# Altium schematic sheet Sheet3.SchDoc
size A3
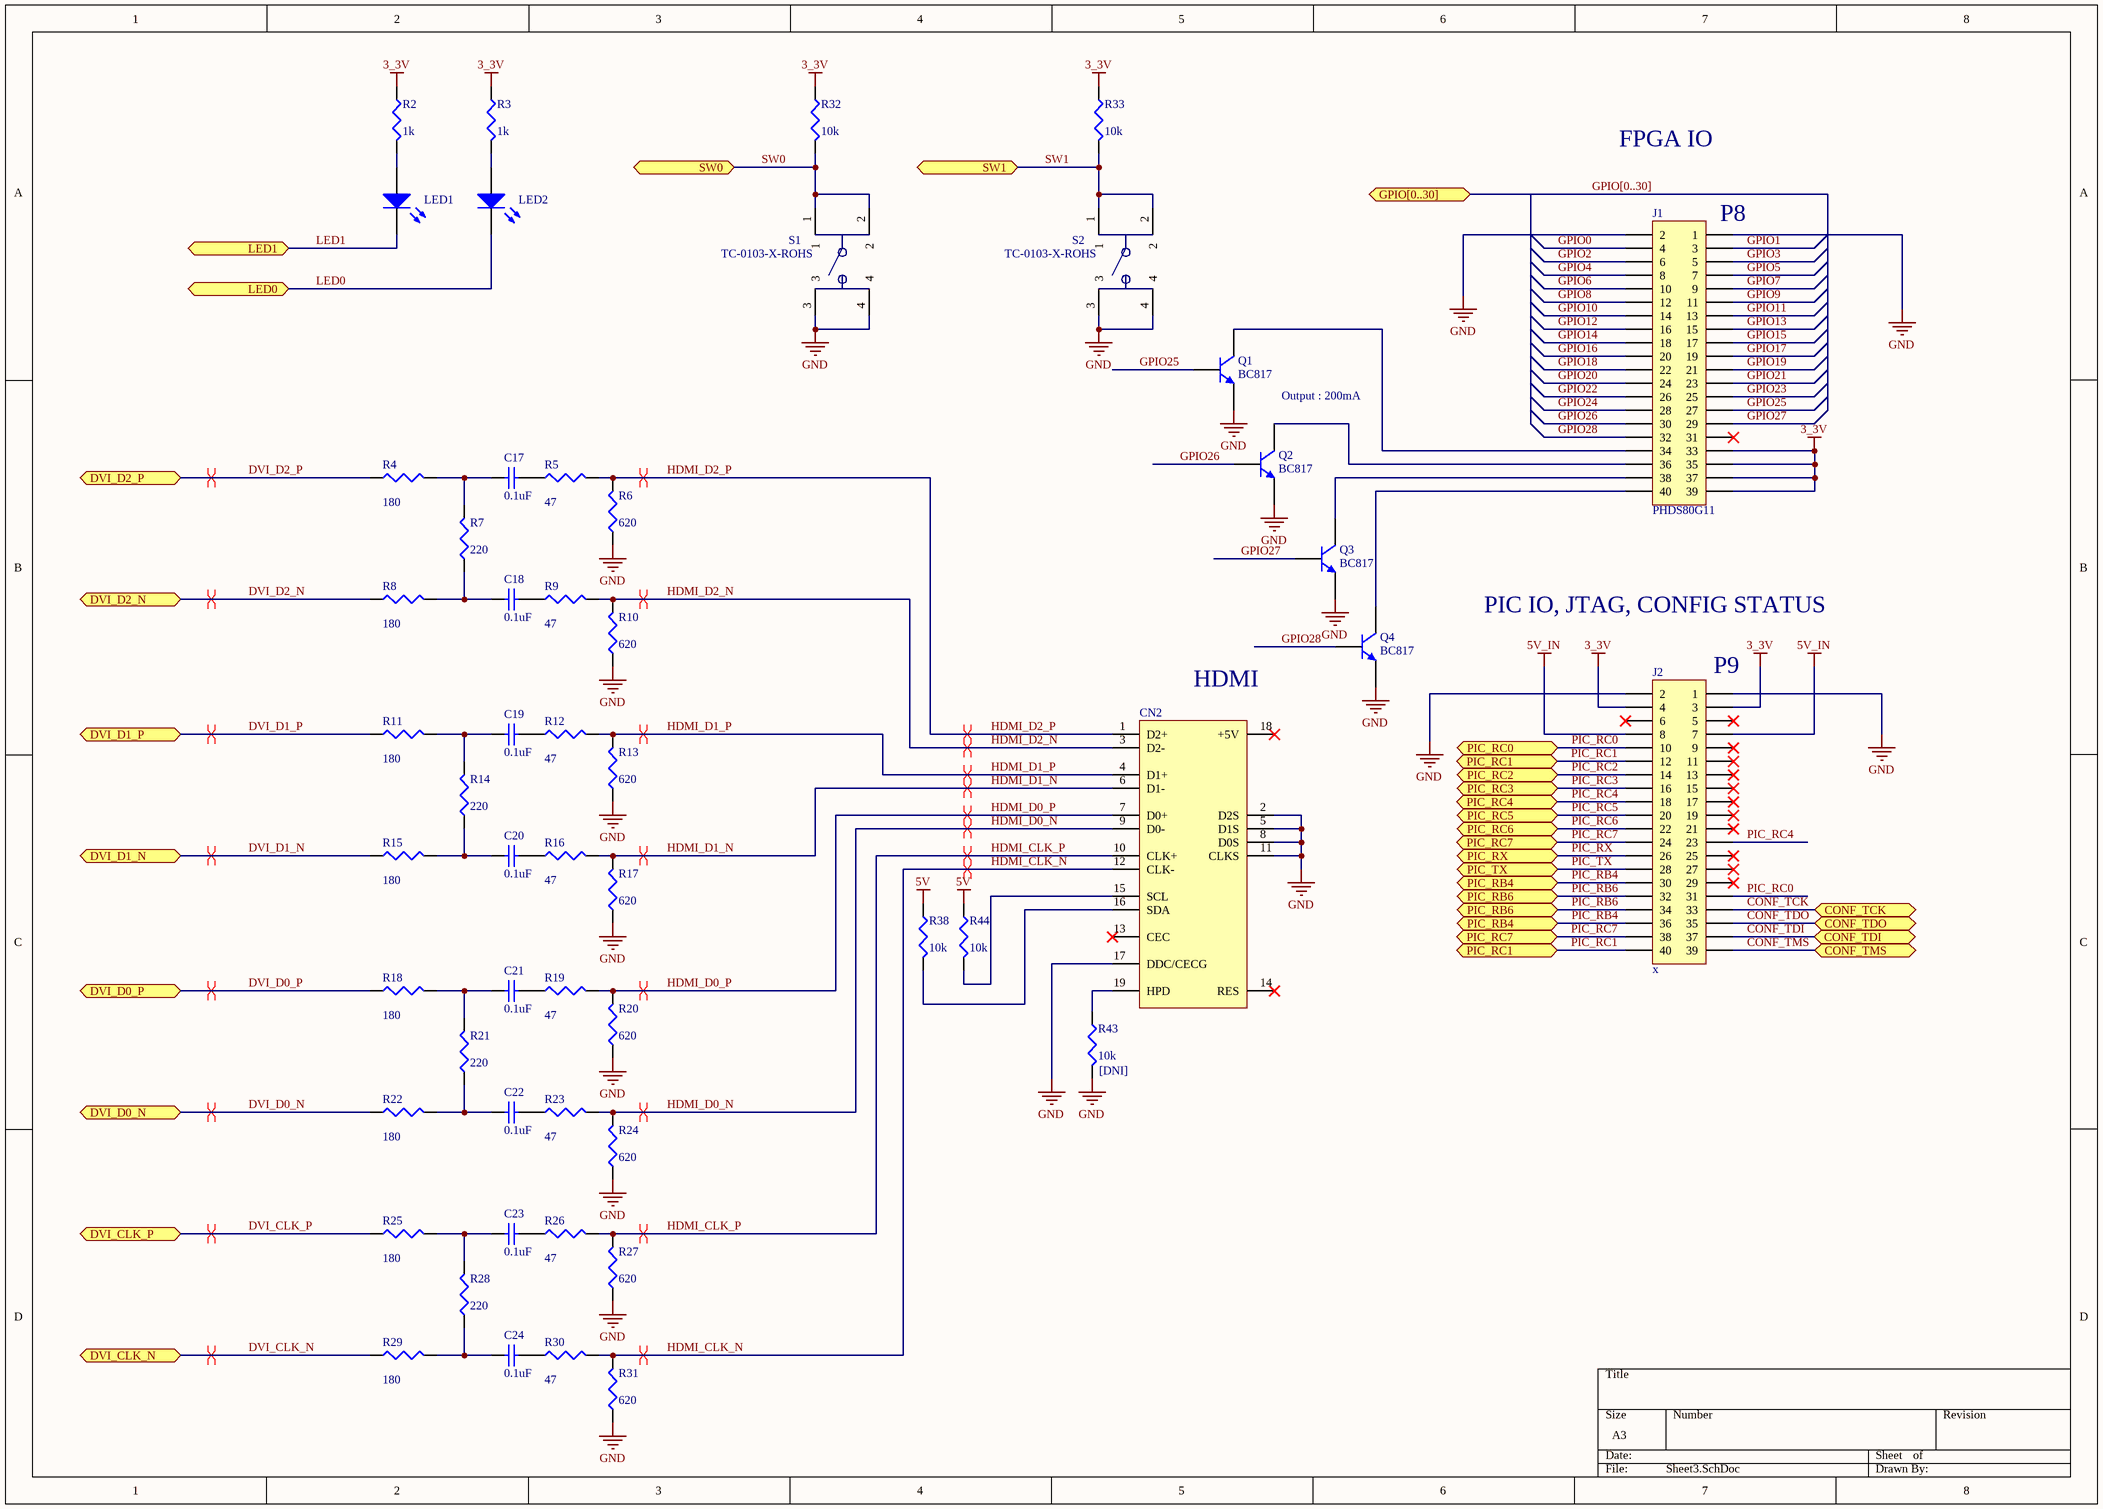
[diagram p0: Sheet3.SchDoc]

## Parts
C17  value 0.1uF  [CHIP1608]  (hidden comment: MCWR06X000 PTL)
C18  value 0.1uF  [CHIP1608]  (hidden comment: MCWR06X000 PTL)
C19  value 0.1uF  [CHIP1608]  (hidden comment: MCWR06X000 PTL)
C20  value 0.1uF  [CHIP1608]  (hidden comment: MCWR06X000 PTL)
C21  value 0.1uF  [CHIP1608]  (hidden comment: MCWR06X000 PTL)
C22  value 0.1uF  [CHIP1608]  (hidden comment: MCWR06X000 PTL)
C23  value 0.1uF  [CHIP1608]  (hidden comment: MCWR06X000 PTL)
C24  value 0.1uF  [CHIP1608]  (hidden comment: MCWR06X000 PTL)
CN2  10029449-001RLF  [10029449-001RLF]  (value not drawn)
J1  PHDS80G11  [HDR2X20-Gemini]
J2  x  [HDR2X20-Gemini]
LED1  TO-3216BC-MAE  [LED3216]  (value not drawn)
LED2  TO-3216BC-MAE  [LED3216]  (value not drawn)
Q1  BC817  [SOT-23]
Q2  BC817  [SOT-23]
Q3  BC817  [SOT-23]
Q4  BC817  [SOT-23]
R2  value 1k  [CHIP1608]  (hidden comment: MCMR06X1001FTL)
R3  value 1k  [CHIP1608]  (hidden comment: MCMR06X1001FTL)
R4  value 180  [CHIP1608]  (hidden comment: MC0063W06031270R)
R5  value 47  [CHIP1608]  (hidden comment: MCWR06X000 PTL)
R6  value 620  [CHIP1608]  (hidden comment: MCMR06X1001FTL)
R7  value 220  [CHIP1608]  (hidden comment: MCMR06X1001FTL)
R8  value 180  [CHIP1608]  (hidden comment: MC0063W06031270R)
R9  value 47  [CHIP1608]  (hidden comment: MCWR06X000 PTL)
R10  value 620  [CHIP1608]  (hidden comment: MCMR06X1001FTL)
R11  value 180  [CHIP1608]  (hidden comment: MC0063W06031270R)
R12  value 47  [CHIP1608]  (hidden comment: MCWR06X000 PTL)
R13  value 620  [CHIP1608]  (hidden comment: MCMR06X1001FTL)
R14  value 220  [CHIP1608]  (hidden comment: MCMR06X1001FTL)
R15  value 180  [CHIP1608]  (hidden comment: MC0063W06031270R)
R16  value 47  [CHIP1608]  (hidden comment: MCWR06X000 PTL)
R17  value 620  [CHIP1608]  (hidden comment: MCMR06X1001FTL)
R18  value 180  [CHIP1608]  (hidden comment: MC0063W06031270R)
R19  value 47  [CHIP1608]  (hidden comment: MCWR06X000 PTL)
R20  value 620  [CHIP1608]  (hidden comment: MCMR06X1001FTL)
R21  value 220  [CHIP1608]  (hidden comment: MCMR06X1001FTL)
R22  value 180  [CHIP1608]  (hidden comment: MC0063W06031270R)
R23  value 47  [CHIP1608]  (hidden comment: MCWR06X000 PTL)
R24  value 620  [CHIP1608]  (hidden comment: MCMR06X1001FTL)
R25  value 180  [CHIP1608]  (hidden comment: MC0063W06031270R)
R26  value 47  [CHIP1608]  (hidden comment: MCWR06X000 PTL)
R27  value 620  [CHIP1608]  (hidden comment: MCMR06X1001FTL)
R28  value 220  [CHIP1608]  (hidden comment: MCMR06X1001FTL)
R29  value 180  [CHIP1608]  (hidden comment: MC0063W06031270R)
R30  value 47  [CHIP1608]  (hidden comment: MCWR06X000 PTL)
R31  value 620  [CHIP1608]  (hidden comment: MCMR06X1001FTL)
R32  value 10k  [CHIP1608]  (hidden comment: MCWR06X1002FTL)
R33  value 10k  [CHIP1608]  (hidden comment: MCWR06X1002FTL)
R38  value 10k  [CHIP1608]  (hidden comment: MCWR06X1002FTL)
R43  value 10k  assembly: [DNI]  [CHIP1608]  (hidden comment: MCWR06X1002FTL)
R44  value 10k  [CHIP1608]  (hidden comment: MCWR06X1002FTL)
S1  TC-0103-X-ROHS  [TACK_SW 6x6mm]
S2  TC-0103-X-ROHS  [TACK_SW 6x6mm]

## Ports
CONF_TCK, CONF_TDI, CONF_TDO, CONF_TMS, DVI_CLK_N, DVI_CLK_P, DVI_D0_N, DVI_D0_P, DVI_D1_N, DVI_D1_P, DVI_D2_N, DVI_D2_P, GPIO[0..30], LED0, LED1, PIC_RB4, PIC_RB6, PIC_RC0, PIC_RC1, PIC_RC2, PIC_RC3, PIC_RC4, PIC_RC5, PIC_RC6, PIC_RC7, PIC_RX, PIC_TX, SW0, SW1

## Nets
3_3V: J1.33 J1.35 J1.37 J1.39 J2.3 J2.4 R2.1 R3.1 R32.1 R33.1
5V: R38.1 R44.1
5V_IN: J2.7 J2.8
GND: CN2.2(D2S) CN2.5(D1S) CN2.8(D0S) CN2.11(CLKS) CN2.17(DDC/CECG) J1.1 J1.2 J2.1 J2.2 Q1.2(E) Q2.2(E) Q3.2(E) Q4.2(E) R6.1 R10.1 R13.1 R17.1 R20.1 R24.1 R27.1 R31.1 R43.2 S1.3 S1.4 S2.3 S2.4
CONF_TCK: J2.33 ; port CONF_TCK
CONF_TDI: J2.37 ; port CONF_TDI
CONF_TDO: J2.35 ; port CONF_TDO
CONF_TMS: J2.39 ; port CONF_TMS
DVI_CLK_N: R29.1 ; port DVI_CLK_N
DVI_CLK_P: R25.1 ; port DVI_CLK_P
DVI_D0_N: R22.1 ; port DVI_D0_N
DVI_D0_P: R18.1 ; port DVI_D0_P
DVI_D1_N: R15.1 ; port DVI_D1_N
DVI_D1_P: R11.1 ; port DVI_D1_P
DVI_D2_N: R8.1 ; port DVI_D2_N
DVI_D2_P: R4.1 ; port DVI_D2_P
GPIO0: J1.4
GPIO1: J1.3
GPIO2: J1.6
GPIO3: J1.5
GPIO4: J1.8
GPIO5: J1.7
GPIO6: J1.10
GPIO7: J1.9
GPIO8: J1.12
GPIO9: J1.11
GPIO10: J1.14
GPIO11: J1.13
GPIO12: J1.16
GPIO13: J1.15
GPIO14: J1.18
GPIO15: J1.17
GPIO16: J1.20
GPIO17: J1.19
GPIO18: J1.22
GPIO19: J1.21
GPIO20: J1.24
GPIO21: J1.23
GPIO22: J1.26
GPIO23: J1.25
GPIO24: J1.28
GPIO25: J1.27 Q1.1(B)
GPIO26: J1.30 Q2.1(B)
GPIO27: J1.29 Q3.1(B)
GPIO28: J1.32 Q4.1(B)
HDMI_CLK_N: CN2.12(CLK-) R30.2 R31.2
HDMI_CLK_P: CN2.10(CLK+) R26.2 R27.2
HDMI_D0_N: CN2.9(D0-) R23.2 R24.2
HDMI_D0_P: CN2.7(D0+) R19.2 R20.2
HDMI_D1_N: CN2.6(D1-) R16.2 R17.2
HDMI_D1_P: CN2.4(D1+) R12.2 R13.2
HDMI_D2_N: CN2.3(D2-) R9.2 R10.2
HDMI_D2_P: CN2.1(D2+) R5.2 R6.2
LED0: LED2.2(K) ; port LED0
LED1: LED1.2(K) ; port LED1
PIC_RB4: J2.30 J2.36 ; port PIC_RB4
PIC_RB6: J2.32 J2.34 ; port PIC_RB6
PIC_RC0: J2.10 J2.31 ; port PIC_RC0
PIC_RC1: J2.12 J2.40 ; port PIC_RC1
PIC_RC2: J2.14 ; port PIC_RC2
PIC_RC3: J2.16 ; port PIC_RC3
PIC_RC4: J2.18 J2.23 ; port PIC_RC4
PIC_RC5: J2.20 ; port PIC_RC5
PIC_RC6: J2.22 ; port PIC_RC6
PIC_RC7: J2.24 J2.38 ; port PIC_RC7
PIC_RX: J2.26 ; port PIC_RX
PIC_TX: J2.28 ; port PIC_TX
SW0: R32.2 S1.1 S1.2 ; port SW0
SW1: R33.2 S2.1 S2.2 ; port SW1
NetC17_1: C17.1 R5.1
NetC17_2: C17.2 R4.2 R7.2
NetC18_1: C18.1 R9.1
NetC18_2: C18.2 R7.1 R8.2
NetC19_1: C19.1 R12.1
NetC19_2: C19.2 R11.2 R14.2
NetC20_1: C20.1 R16.1
NetC20_2: C20.2 R14.1 R15.2
NetC21_1: C21.1 R19.1
NetC21_2: C21.2 R18.2 R21.2
NetC22_1: C22.1 R23.1
NetC22_2: C22.2 R21.1 R22.2
NetC23_1: C23.1 R26.1
NetC23_2: C23.2 R25.2 R28.2
NetC24_1: C24.1 R30.1
NetC24_2: C24.2 R28.1 R29.2
NetCN2_15: CN2.15(SCL) R44.2
NetCN2_16: CN2.16(SDA) R38.2
NetCN2_19: CN2.19(HPD) R43.1
NetJ1_34: J1.34 Q1.3(C)
NetJ1_36: J1.36 Q2.3(C)
NetJ1_38: J1.38 Q3.3(C)
NetJ1_40: J1.40 Q4.3(C)
NetLED1_1: LED1.1(A) R2.2
NetLED2_1: LED2.1(A) R3.2

Not connected (* = marked no-connect by the designer): CN2 13(CEC)* 14(RES)* 18(+5V)*; J1 31*; J2 5* 6* 9* 11* 13* 15* 17* 19* 21* 25* 27* 29*

## Buses and harness runs
bus GPIO[0..30] = port GPIO[0..30]

## Layout directives
differential pair: DVI_CLK_N, DVI_CLK_P, DVI_D0_N, DVI_D0_P, DVI_D1_N, DVI_D1_P, DVI_D2_N, DVI_D2_P, HDMI_CLK_N, HDMI_CLK_P, HDMI_D0_N, HDMI_D0_P, HDMI_D1_N, HDMI_D1_P, HDMI_D2_N, HDMI_D2_P

## Notes on the sheet
- FPGA IO
- (near J1) P8
- Output : 200mA
- PIC IO, JTAG, CONFIG STATUS
- (near CN2) HDMI
- (near J2) P9

## Library data of the parts
C17-C24 = Cap Semi: Capacitor (Semiconductor SIM Model); Published: 8-Jun-2000; LatestRevisionDate: 17-Jul-2002; LatestRevisionNote: Re-released for DXP Platform.; PackageReference: C1206; Publisher: Altium Limited; part2: CC0603KRX7R9BB104
CN2 = HDMI_Connector: Vendor: Mouser -> maybe element (connector may have to pay TAX); part2: 10029449-001RLF
J1 J2 = Header 20X2: Header, 20-Pin, Dual row; Vendor: ES; LatestRevisionDate: 17-Jul-2002; LatestRevisionNote: Re-released for DXP Platform.; Publisher: Altium Limited
LED1 LED2 = LED2: OASISTEK (TO-3216BC-MAE); Vendor: ES; Published: 8-Jun-2000; LatestRevisionDate: 17-Jul-2002; LatestRevisionNote: Re-released for DXP Platform.; PackageDocument: Feb-2002; PackageReference: 3.2X1.6X1.1; Publisher: Altium Limited; part2: APTR3216SGC
Q1-Q4 = BC817: NPN General Purpose Amplifier; Published: 8-Jun-2000; LatestRevisionDate: 15-Jan-2003; LatestRevisionNote: PCB Footprint 'BCY-W3/D4.7' replaced; DatasheetVersion: 1997; PackageVersion: Sep-1998; PackageReference: TO-92A; Publisher: Altium Limited; PackageDescription: TO, Flat Index; 3 In-Line, Axial Leads; Body Dia. 4.5mm; Leads 0.51 x 0.48 mm (max); ComponentLink1Description: Manufacturer Link; ComponentLink1URL: http://www.fairchildsemi.com/; ComponentLink2Description: Datasheet; ComponentLink2URL: http://www.fairchildsemi.com/ds/2N%2F2N3904.pdf; part2: MMBT3904LT1G
R2-R33 R38 R43 R44 = Res3: Resistor; Published: 8-Jun-2000; LatestRevisionDate: 04-Mar-2005; LatestRevisionNote: PCB Footprint replaced.; PackageReference: J1-0603; Publisher: Altium Limited
  R2 R3: part2: RC0603JR-071KL
  R4 R8 R11 R15 R18 R22 R25 R29: part2: RC0603FR-07180RL
  R5 R9 R12 R16 R19 R23 R26 R30: part2: RC0603FR-0747RL
  R6 R10 R13 R17 R20 R24 R27 R31: part2: RC0603FR-07620RL
  R7 R14 R21 R28: part2: RC0603FR-07220RL
  R32 R33 R38 R43 R44: part2: RC0603JR-0710KL
S1 S2 = TC-0103-X-ROHS: WEALTH METAL; Vendor: ES